# Altium project wien.PrjPCB
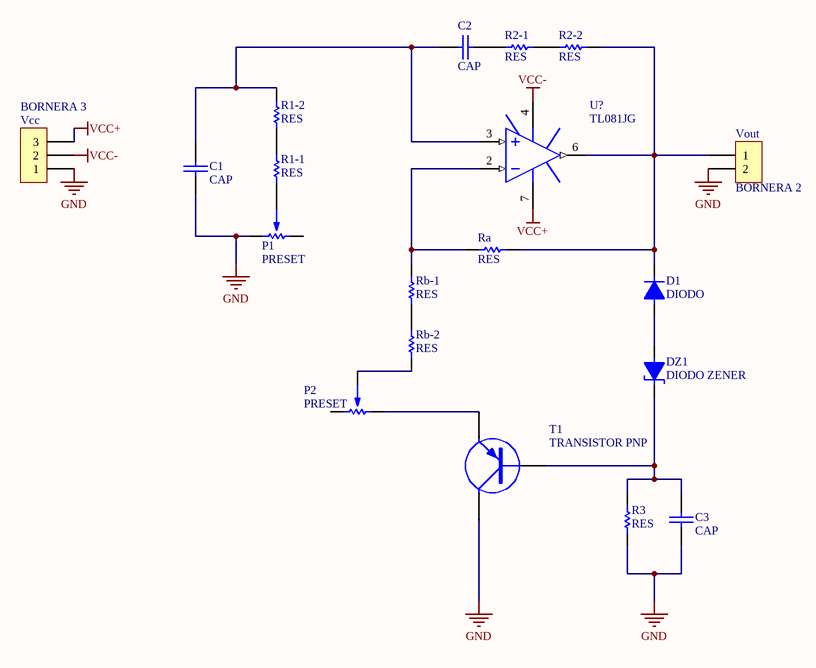
[diagram p0: wien.SchDoc]
1 sheet, 19 parts. Net scope: global (net labels, ports and power ports of the same name join across sheets).
Board file: wien.PcbDoc

## Sheet wien.SchDoc
size A

### Parts
C1  CAP  [CAP200]
C2  CAP  [CAP200]
C3  CAP  [CAP200]
D1  DIODO  [DO41]
DZ1  DIODO ZENER  [DO41]
P1  PRESET  [PRESET V]
P2  PRESET  [PRESET V]
R1-1  RES  [1206]
R1-2  RES  [1206]
R2-1  RES  [1206]
R2-2  RES  [1206]
R3  RES  [1206]
Ra  RES  [1206]
Rb-1  RES  [1206]
Rb-2  RES  [1206]
T1  TRANSISTOR PNP  [TO92]
U?  TL081JG  [JG008]
Vcc  BORNERA 3  [BORNERA3]
Vout  BORNERA 2  [BORNERA2]

### Nets
GND: C1.1 C3.2 P1.1 R3.2 T1.2(C) Vcc.1 Vout.2
VCC+: U?.7(V+) Vcc.3
VCC-: U?.4(V-) Vcc.2
NetC1_2: C1.2 C2.2 R1-2.2 U?.3(IN+)
NetC2_1: C2.1 R2-1.1
NetC3_1: C3.1 DZ1.2 R3.1 T1.1(B)
NetD1_1: D1.1 DZ1.1
NetD1_2: D1.2 R2-2.2 Ra.1 U?.6(OUT) Vout.1
NetP1_2: P1.2 R1-1.1
NetP2_2: P2.2 Rb-2.1
NetP2_3: P2.3 T1.3(E)
NetR1-1_2: R1-1.2 R1-2.1
NetR2-1_2: R2-1.2 R2-2.1
NetRa_2: Ra.2 Rb-1.2 U?.2(IN-)
NetRb-1_1: Rb-1.1 Rb-2.2

Not connected (* = marked no-connect by the designer): P1 3; P2 1; U? 1(OS_TRIM) 5(OS_TRIM) 8(NC)

### Library data of the parts
U? = TL081JG: JFET-Input Operational Amplifier; Note: Pin 8 is not connected; Published: 16-Jan-2001; LatestRevisionDate: 04-Mar-2005; LatestRevisionNote: Stylized 3D Model Added.; DatasheetVersion: Feb-1999; PackageVersion: Jan-1995; PackageReference: JG008; Publisher: Altium Limited; PackageDescription: DIP; 8 Leads; Row Spacing 7.62 mm; Pitch 2.54 mm; ComponentLink1Description: Manufacturer Link; ComponentLink1URL: http://www.ti.com/; ComponentLink2Description: Datasheet; ComponentLink2URL: http://www-s.ti.com/sc/ds/tl081.pdf